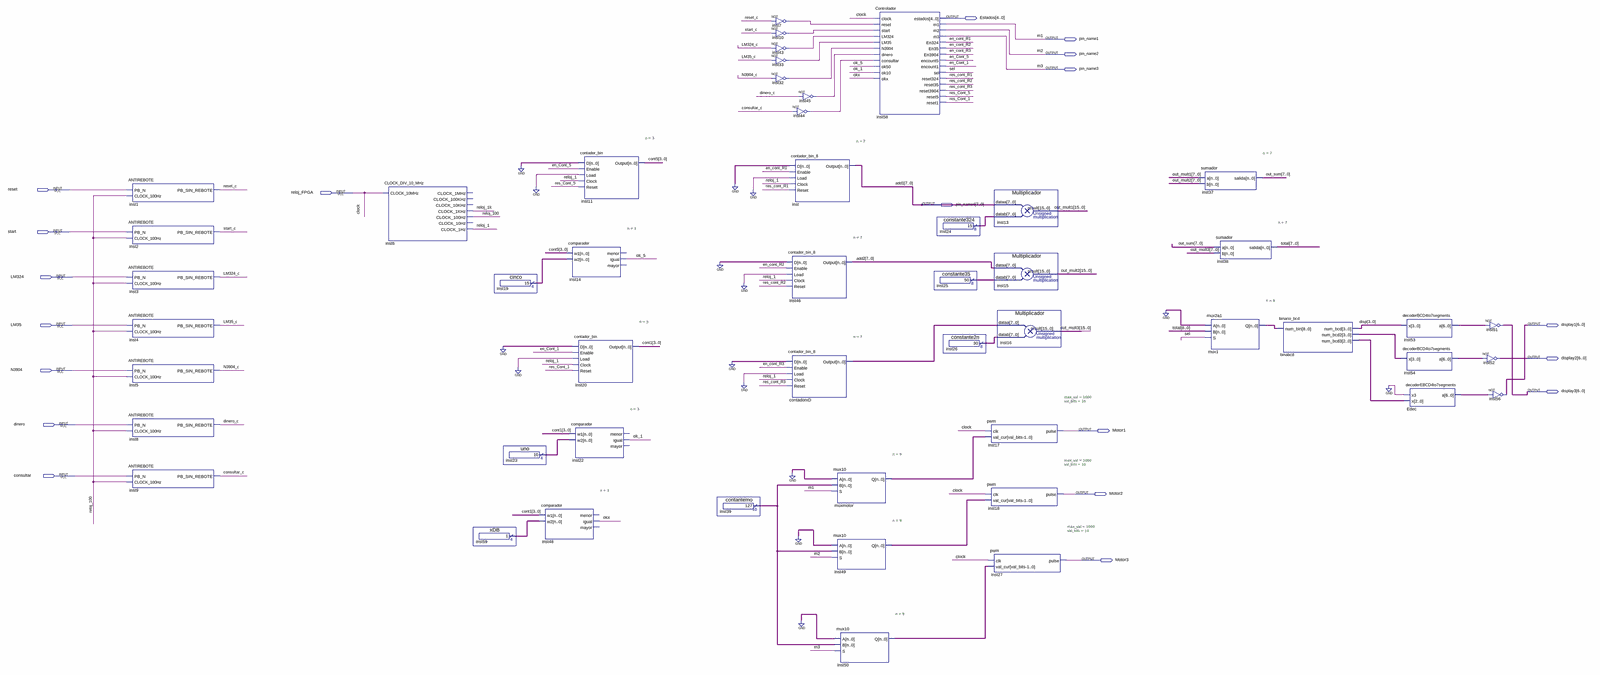
[diagram p0: schematic sheet, whole]
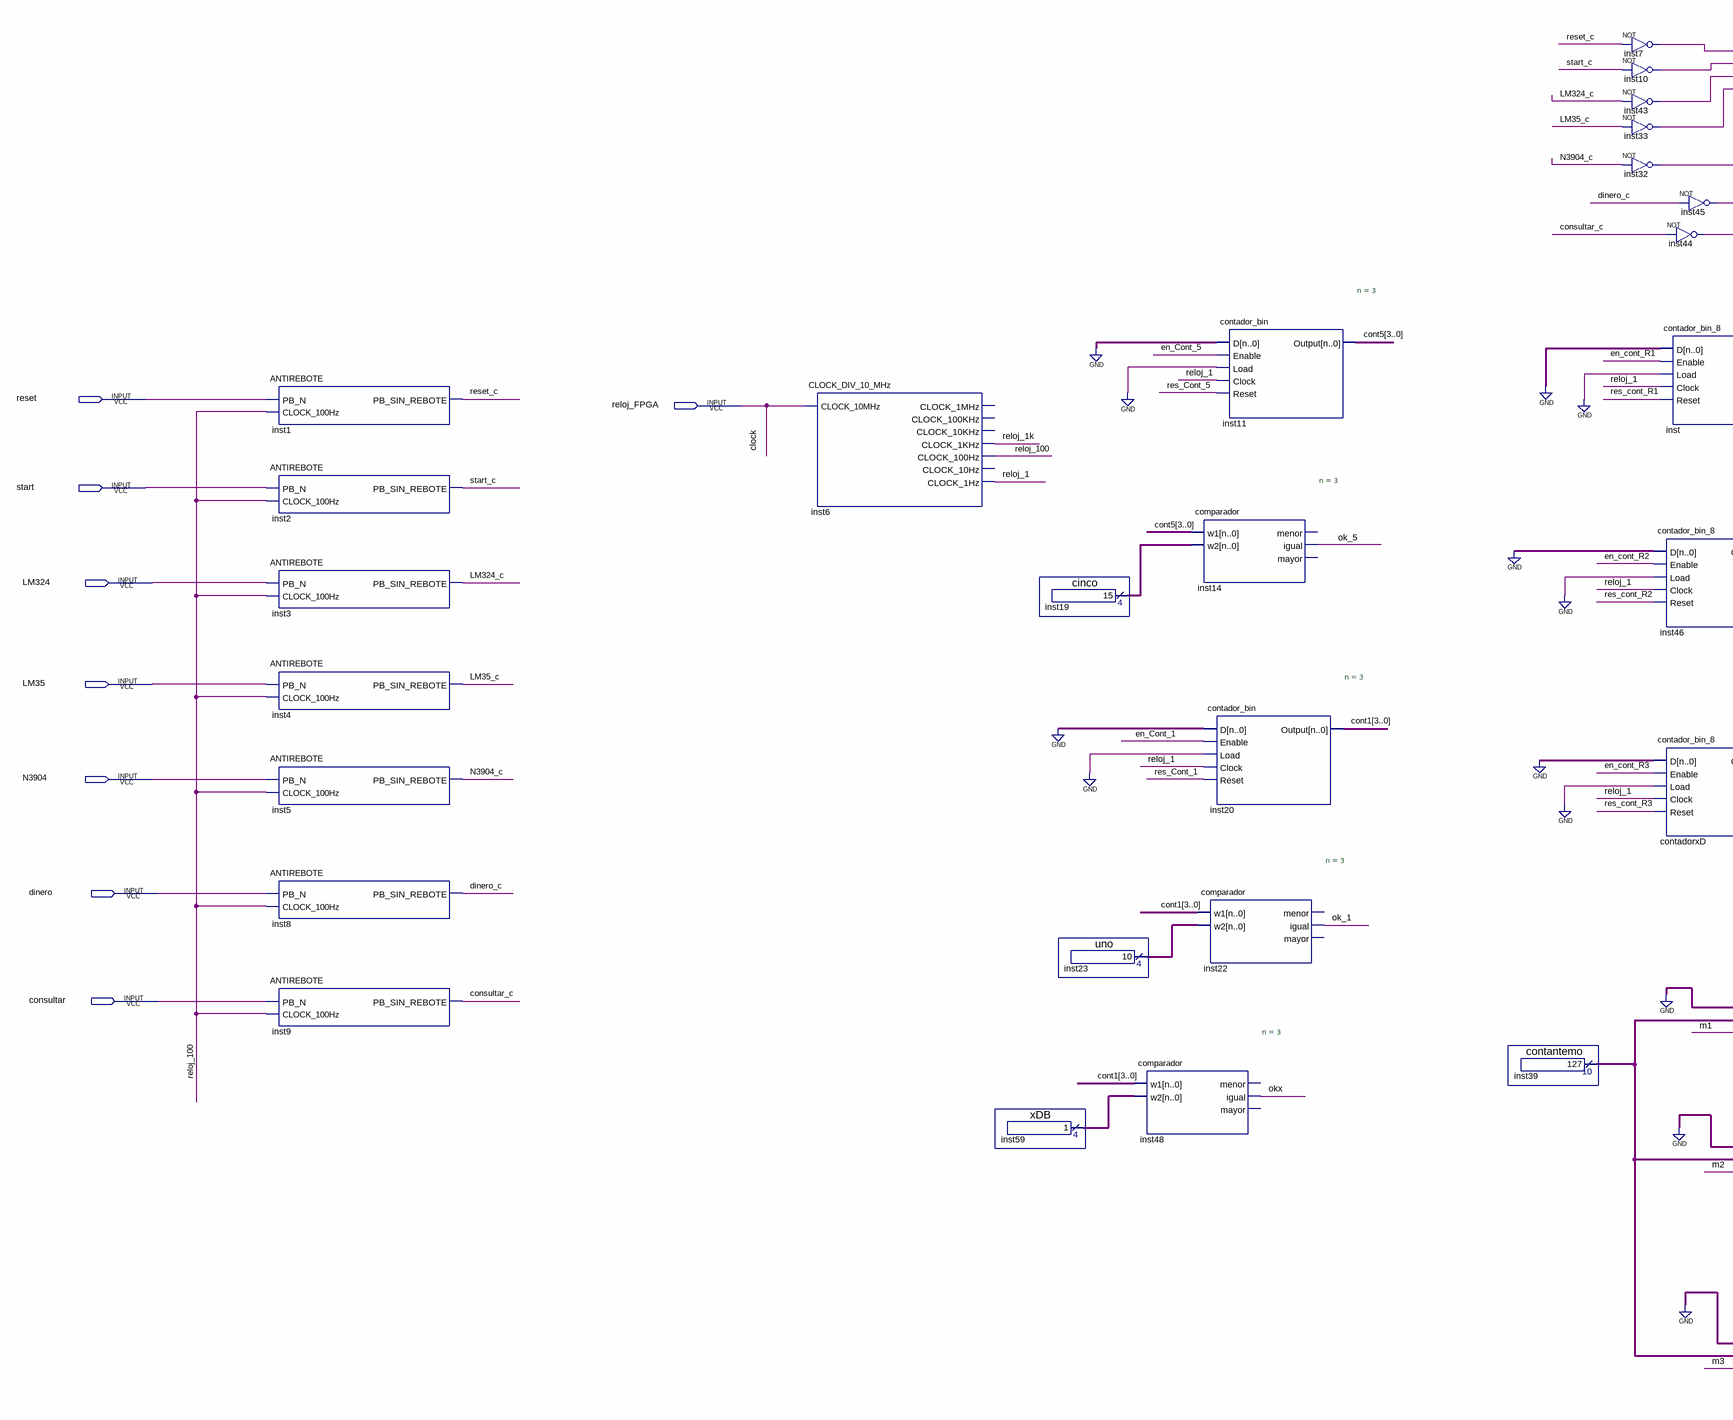
[diagram p1: schematic sheet, left part]
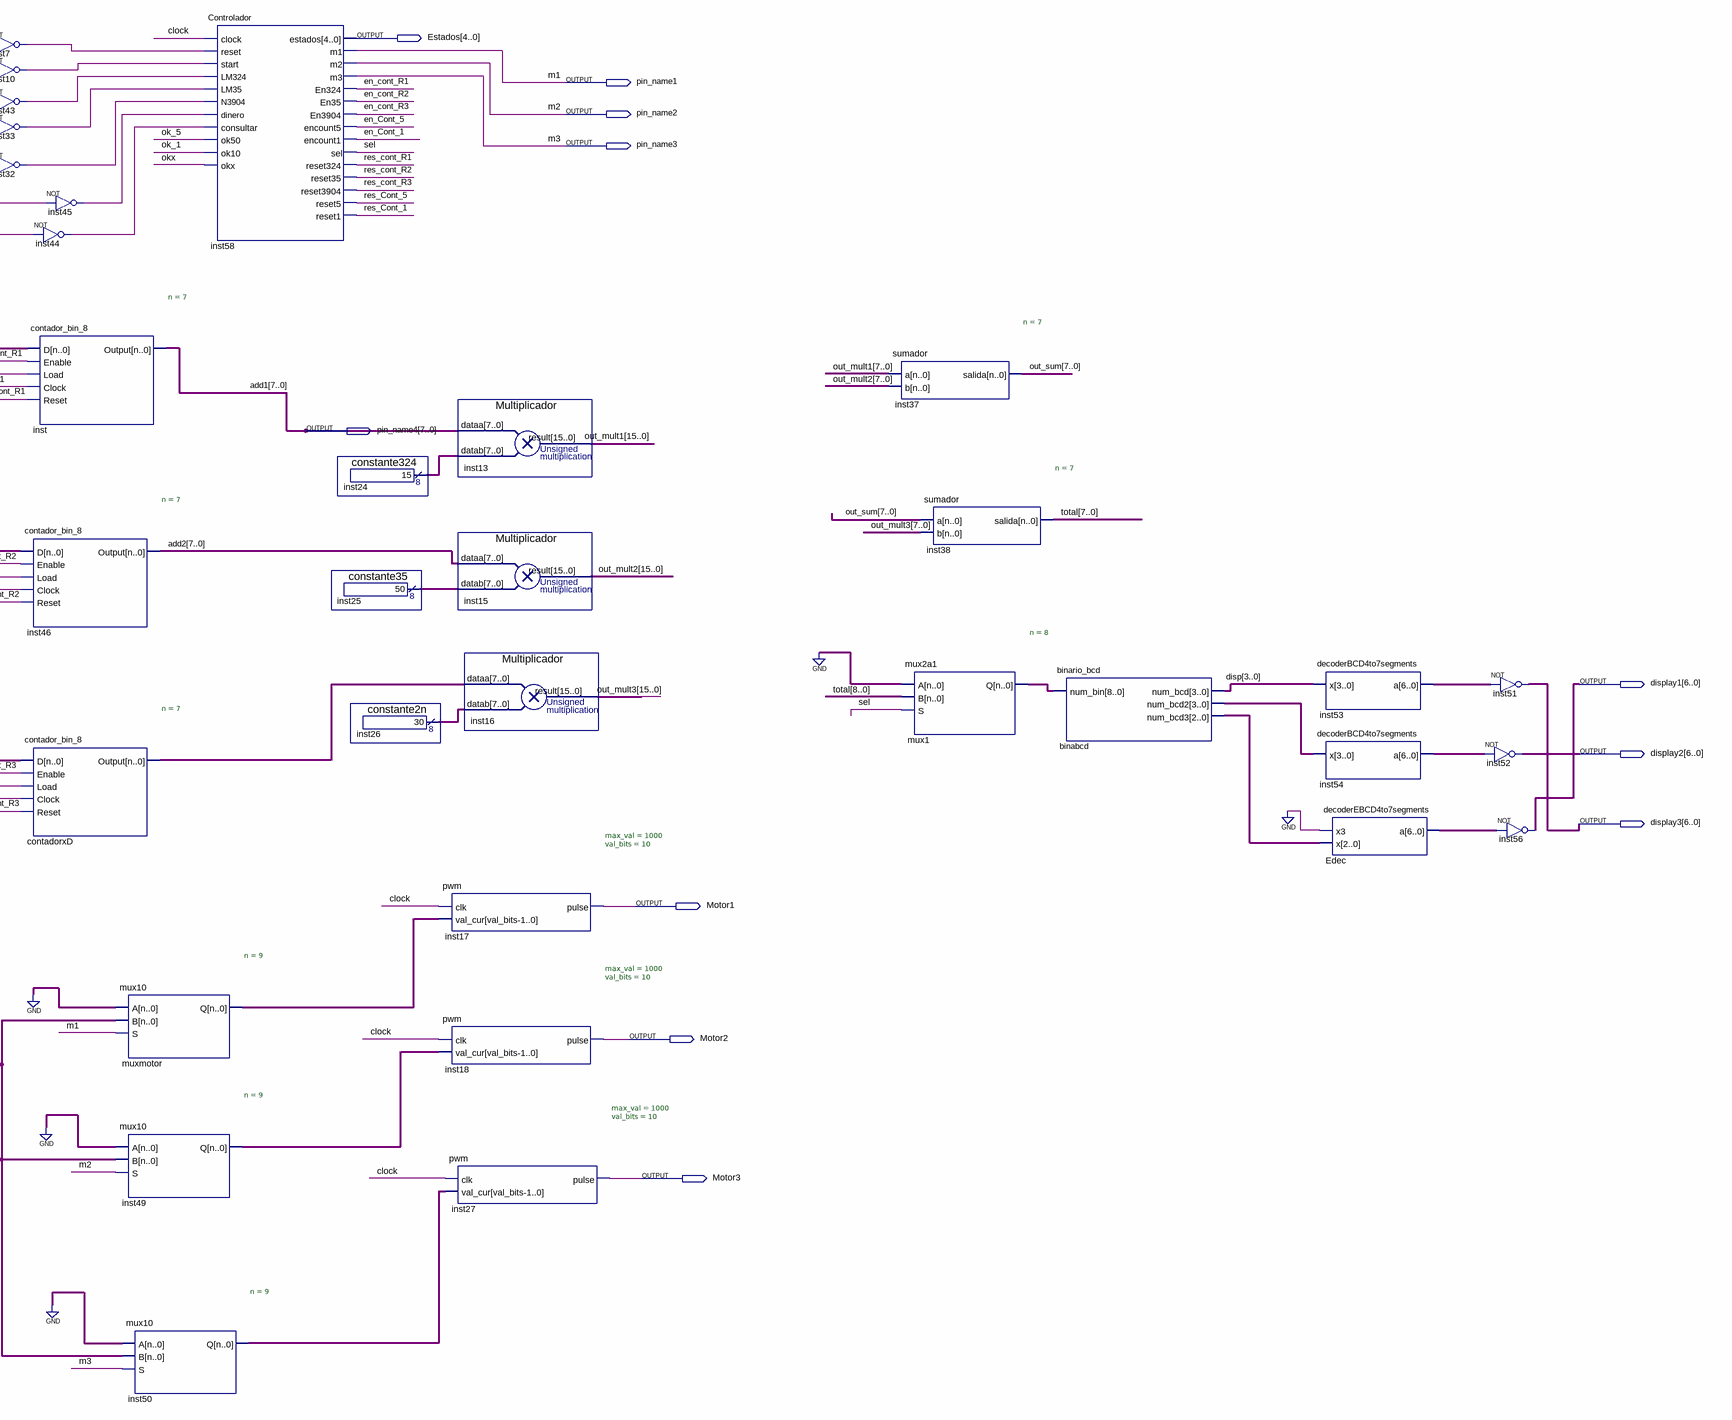
[diagram p2: schematic sheet, right part]
// Quartus schematic partefuncional.bdf as structural Verilog: 50 symbols, 19 pins
module partefuncional (
  input  reset,
  input  reloj_FPGA,
  input  start,
  input  LM324,
  input  LM35,
  input  N3904,
  input  dinero,
  input  consultar,
  output [4:0] Estados,
  output pin_name1,
  output pin_name2,
  output pin_name3,
  output [7:0] pin_name4,
  output [6:0] display1,
  output [6:0] display2,
  output [6:0] display3,
  output Motor1,
  output Motor2,
  output Motor3
);

  wire consultar_c, dinero_c, en_Cont_1, en_Cont_5, en_cont_R1, en_cont_R2, en_cont_R3, inst7_out,
       inst10_out, inst32_out, inst33_out, inst43_out, inst44_out, inst45_out, LM35_c, LM324_c, N3904_c,
       ok_1, ok_5, okx, reloj_1, reloj_1k, reloj_100, res_Cont_1, res_Cont_5, res_cont_R1, res_cont_R2,
       res_cont_R3, reset_c, sel, start_c;
  wire [2:0] binabcd_num_bcd3;
  wire [3:0] binabcd_num_bcd2, cont1, cont5, disp, inst19_result, inst23_result, inst59_result;
  wire [6:0] Edec_a, inst53_a, inst54_a;
  wire [7:0] add2, contadorxD_output, inst24_result, inst25_result, inst26_result, out_sum;
  wire [8:0] mux1_q, total;
  wire [9:0] inst39_result, inst49_q, inst50_q, muxmotor_q;
  wire [15:0] out_mult1, out_mult2, out_mult3;

  ANTIREBOTE inst1 (.PB_N(reset), .CLOCK_100Hz(reloj_100), .PB_SIN_REBOTE(reset_c));
  ANTIREBOTE inst2 (.PB_N(start), .CLOCK_100Hz(reloj_100), .PB_SIN_REBOTE(start_c));
  ANTIREBOTE inst3 (.PB_N(LM324), .CLOCK_100Hz(reloj_100), .PB_SIN_REBOTE(LM324_c));
  ANTIREBOTE inst4 (.PB_N(LM35), .CLOCK_100Hz(reloj_100), .PB_SIN_REBOTE(LM35_c));
  ANTIREBOTE inst5 (.PB_N(N3904), .CLOCK_100Hz(reloj_100), .PB_SIN_REBOTE(N3904_c));
  ANTIREBOTE inst8 (.PB_N(dinero), .CLOCK_100Hz(reloj_100), .PB_SIN_REBOTE(dinero_c));
  ANTIREBOTE inst9 (.PB_N(consultar), .CLOCK_100Hz(reloj_100), .PB_SIN_REBOTE(consultar_c));
  CLOCK_DIV_10_MHz inst6 (
    .CLOCK_10MHz(reloj_FPGA), .CLOCK_1KHz(reloj_1k), .CLOCK_100Hz(reloj_100), .CLOCK_1Hz(reloj_1));  // open: CLOCK_1MHz, CLOCK_100KHz, CLOCK_10KHz, CLOCK_10Hz
  xDB inst59 (.result(inst59_result));
  cinco inst19 (.result(inst19_result));
  uno inst23 (.result(inst23_result));
  comparador #(.n(3)) inst48 (.w1(cont1), .w2(inst59_result), .igual(okx));  // open: menor, mayor
  contador_bin #(.n(3)) inst11 (
    .D(4'b0000), .Enable(en_Cont_5), .Load(1'b0), .Clock(reloj_1), .Reset(res_Cont_5), .Output(cont5));
  comparador #(.n(3)) inst14 (.w1(cont5), .w2(inst19_result), .igual(ok_5));  // open: menor, mayor
  contador_bin #(.n(3)) inst20 (
    .D(4'b0000), .Enable(en_Cont_1), .Load(1'b0), .Clock(reloj_1), .Reset(res_Cont_1), .Output(cont1));
  comparador #(.n(3)) inst22 (.w1(cont1), .w2(inst23_result), .igual(ok_1));  // open: menor, mayor
  contantemo inst39 (.result(inst39_result));
  not inst7 (inst7_out, reset_c);
  not inst10 (inst10_out, start_c);
  not inst43 (inst43_out, LM324_c);
  not inst33 (inst33_out, LM35_c);
  not inst32 (inst32_out, N3904_c);
  not inst44 (inst44_out, consultar_c);
  contador_bin_8 #(.n(7)) inst (
    .D({8{1'b0}}), .Enable(en_cont_R1), .Load(1'b0), .Clock(reloj_1), .Reset(res_cont_R1), .Output(pin_name4));
  contador_bin_8 #(.n(7)) inst46 (
    .D({8{1'b0}}), .Enable(en_cont_R2), .Load(1'b0), .Clock(reloj_1), .Reset(res_cont_R2), .Output(add2));
  contador_bin_8 #(.n(7)) contadorxD (
    .D({8{1'b0}}), .Enable(en_cont_R3), .Load(1'b0), .Clock(reloj_1), .Reset(res_cont_R3),
    .Output(contadorxD_output));
  not inst45 (inst45_out, dinero_c);
  mux10 #(.n(9)) muxmotor (.A({10{1'b0}}), .B(inst39_result), .S(pin_name1), .Q(muxmotor_q));
  mux10 #(.n(9)) inst49 (.A({10{1'b0}}), .B(inst39_result), .S(pin_name2), .Q(inst49_q));
  mux10 #(.n(9)) inst50 (.A({10{1'b0}}), .B(inst39_result), .S(pin_name3), .Q(inst50_q));
  Controlador inst58 (
    .clock(reloj_FPGA), .reset(inst7_out), .start(inst10_out), .LM324(inst43_out), .LM35(inst33_out),
    .N3904(inst32_out), .dinero(inst45_out), .consultar(inst44_out), .ok50(ok_5), .ok10(ok_1), .okx(okx),
    .estados(Estados), .m1(pin_name1), .m2(pin_name2), .m3(pin_name3), .En324(en_cont_R1), .En35(en_cont_R2),
    .En3904(en_cont_R3), .encount5(en_Cont_5), .encount1(en_Cont_1), .sel(sel), .reset324(res_cont_R1),
    .reset35(res_cont_R2), .reset3904(res_cont_R3), .reset5(res_Cont_5), .reset1(res_Cont_1));
  constante324 inst24 (.result(inst24_result));
  constante35 inst25 (.result(inst25_result));
  constante2n inst26 (.result(inst26_result));
  pwm #(.max_val(1000), .val_bits(10)) inst17 (.clk(reloj_FPGA), .val_cur(muxmotor_q), .pulse(Motor1));
  pwm #(.max_val(1000), .val_bits(10)) inst18 (.clk(reloj_FPGA), .val_cur(inst49_q), .pulse(Motor2));
  pwm #(.max_val(1000), .val_bits(10)) inst27 (.clk(reloj_FPGA), .val_cur(inst50_q), .pulse(Motor3));
  Multiplicador inst13 (.dataa(pin_name4), .datab(inst24_result), .result(out_mult1));
  Multiplicador inst15 (.dataa(add2), .datab(inst25_result), .result(out_mult2));
  Multiplicador inst16 (.dataa(contadorxD_output), .datab(inst26_result), .result(out_mult3));
  sumador #(.n(7)) inst37 (.a(out_mult1[7:0]), .b(out_mult2[7:0]), .salida(out_sum));
  mux2a1 #(.n(8)) mux1 (.A({9{1'b0}}), .B(total), .S(sel), .Q(mux1_q));
  sumador #(.n(7)) inst38 (.a(out_sum), .b(out_mult3[7:0]), .salida(total[7:0]));
  binario_bcd binabcd (.num_bin(mux1_q), .num_bcd(disp), .num_bcd2(binabcd_num_bcd2), .num_bcd3(binabcd_num_bcd3));
  decoderBCD4to7segments inst53 (.x(disp), .a(inst53_a));
  decoderBCD4to7segments inst54 (.x(binabcd_num_bcd2), .a(inst54_a));
  decoderEBCD4to7segments Edec (.x3(1'b0), .x(binabcd_num_bcd3), .a(Edec_a));
  assign display3 = ~inst53_a;  // NOT inst51, 7 bits wide
  assign display2 = ~inst54_a;  // NOT inst52, 7 bits wide
  assign display1 = ~Edec_a;  // NOT inst56, 7 bits wide

  // Other names for the same wires on the sheet: add1[7:0] = pin_name4; clock = reloj_FPGA; m1 = pin_name1;
  //   m2 = pin_name2; m3 = pin_name3
endmodule
